# Altium schematic sheet Power Management.SchDoc (part 2 of 3)
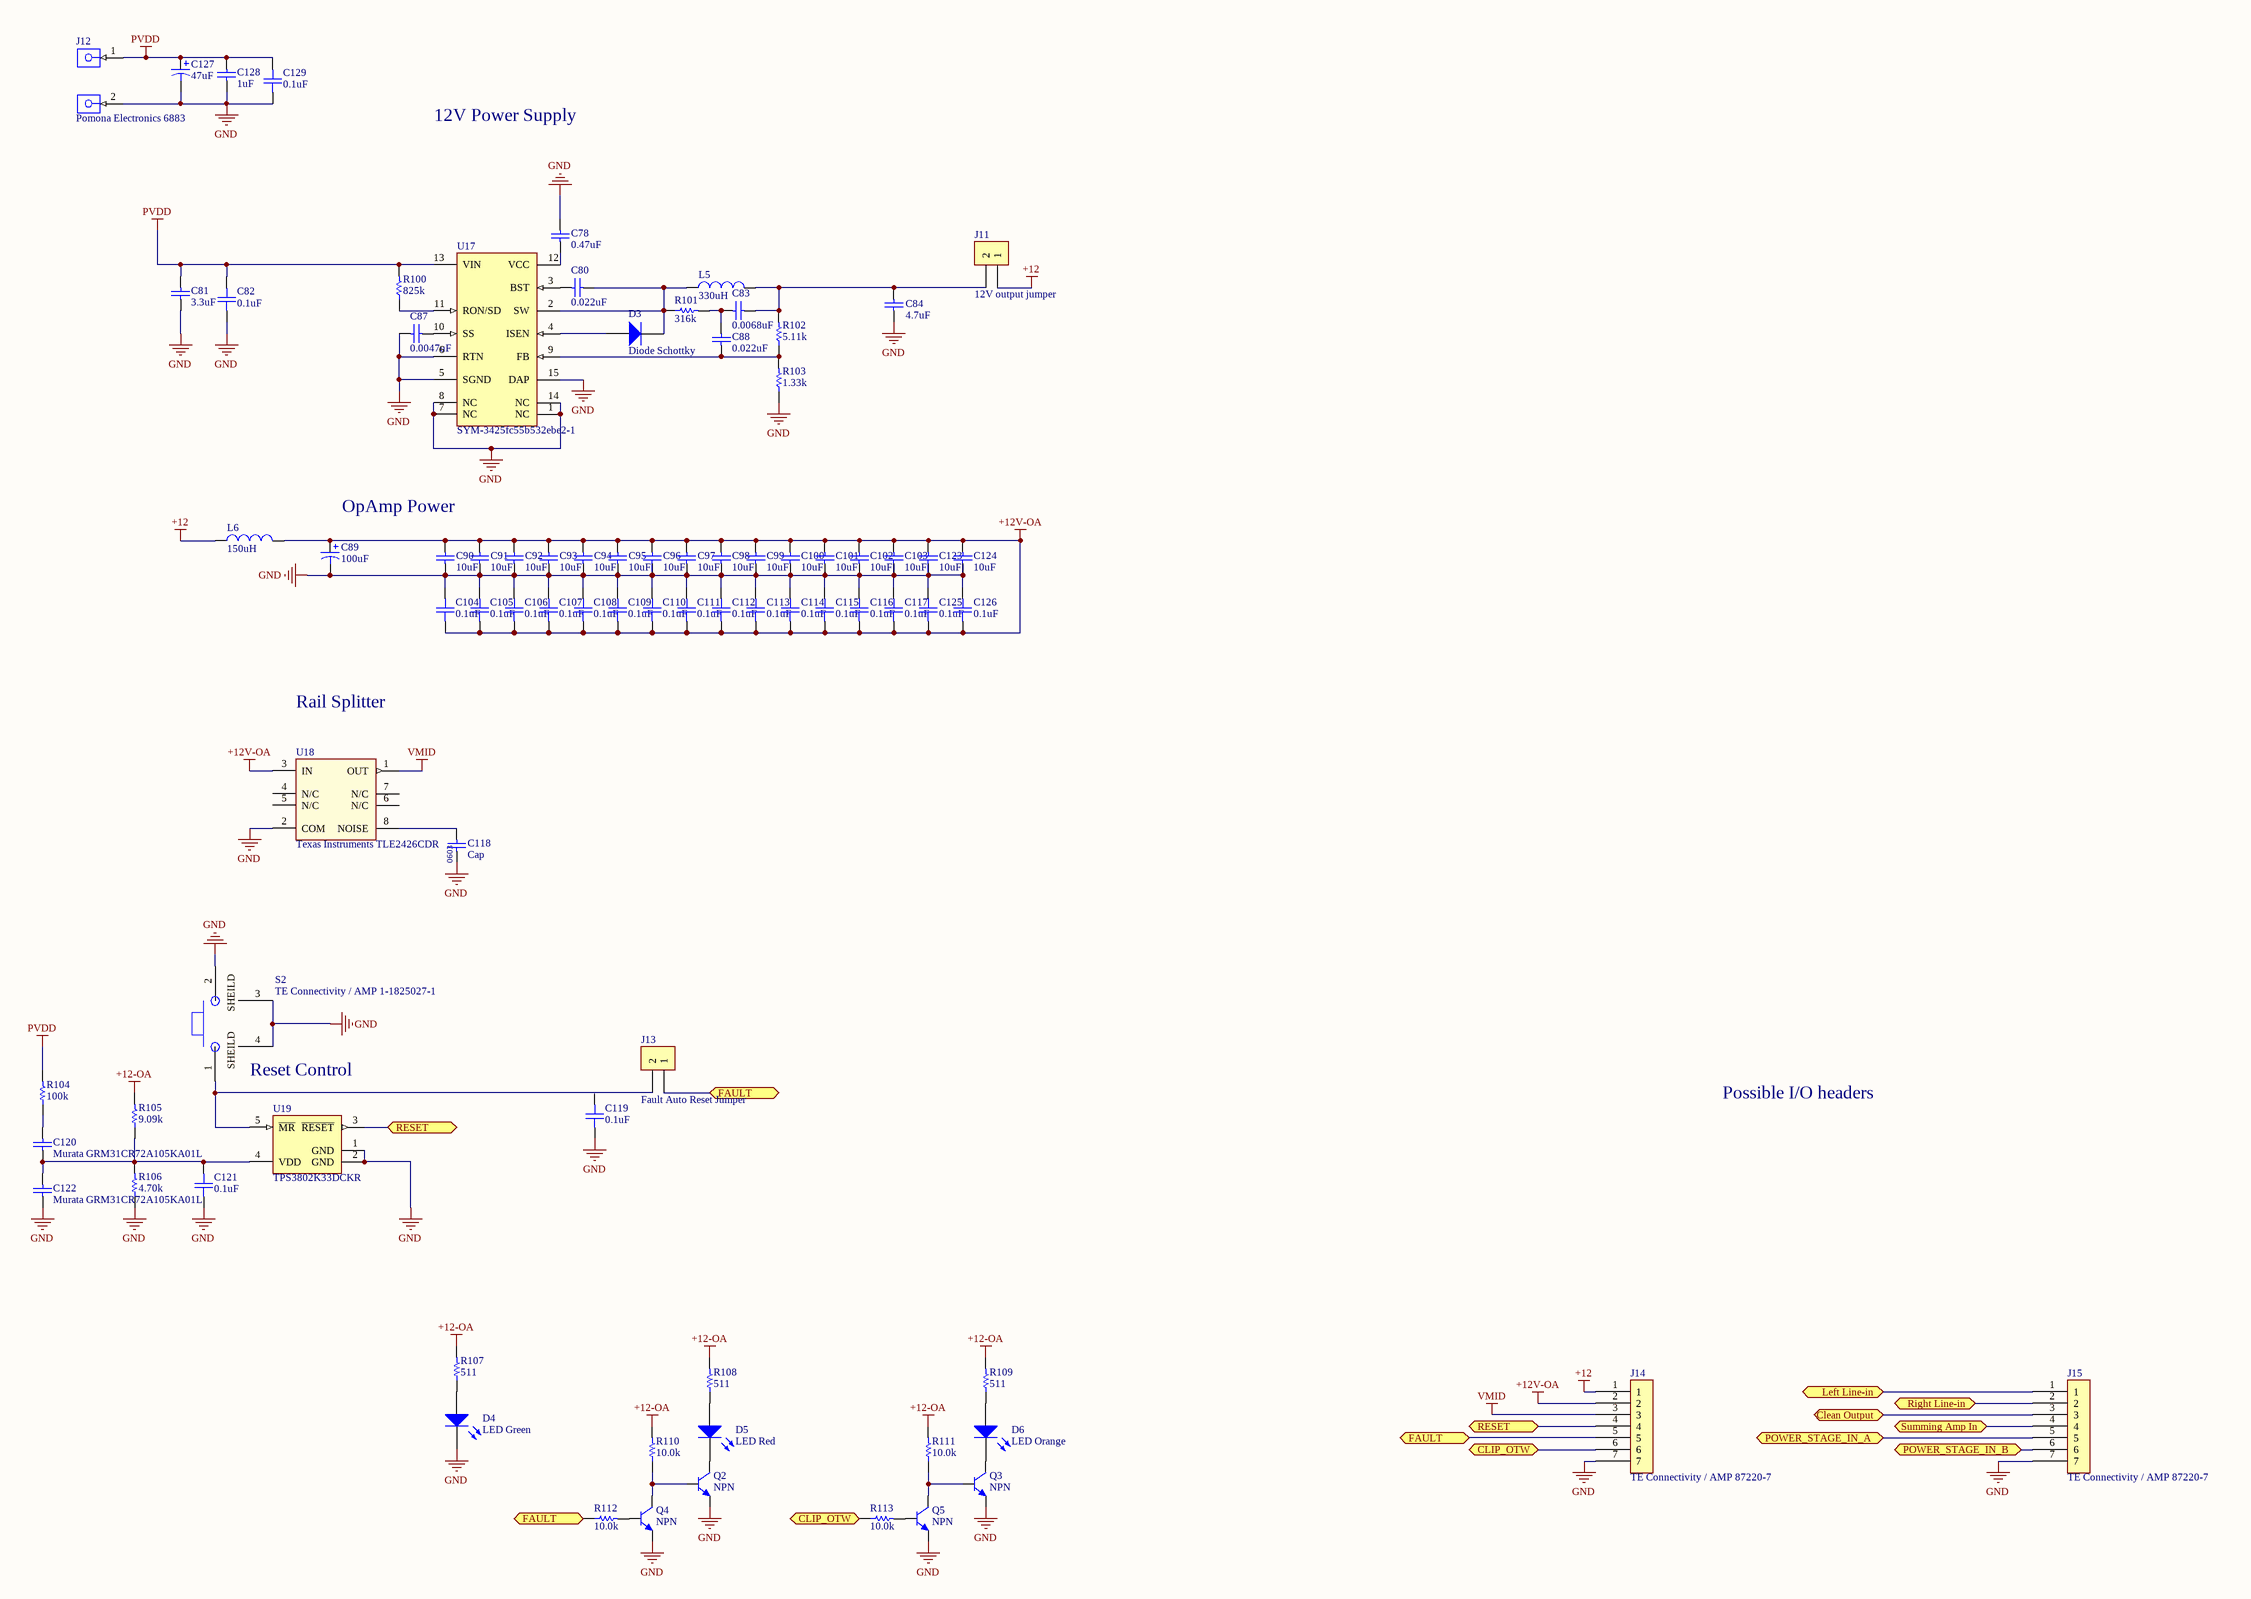
[diagram p1: Power Management.SchDoc]

## Library data of the parts (continued)
C89 = CMP-0978c15ef0cfd6bf-1: Cap Aluminum Lytic 100uF 25V 20% (6.3 X 7.7mm) SMD 290mA 5000h 105